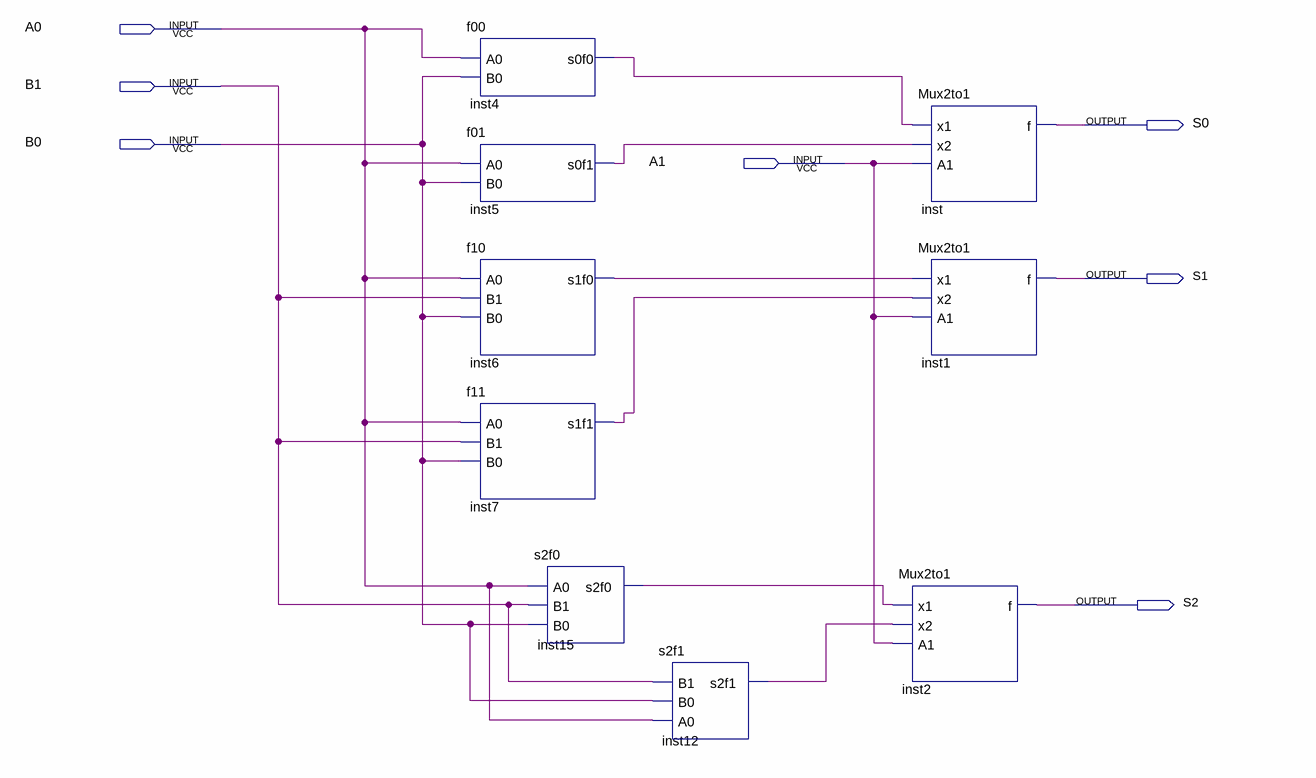
[diagram p0: schematic sheet]
// Quartus schematic Lab4.bdf as structural Verilog: 9 symbols, 7 pins
module Lab4 (
  input  A0,
  input  B1,
  input  B0,
  input  A1,
  output S0,
  output S1,
  output S2
);

  wire inst4_s0f0, inst5_s0f1, inst6_s1f0, inst7_s1f1, inst12_s2f1, inst15_s2f0;

  f00 inst4 (.A0(A0), .B0(B0), .s0f0(inst4_s0f0));
  f01 inst5 (.A0(A0), .B0(B0), .s0f1(inst5_s0f1));
  f10 inst6 (.A0(A0), .B1(B1), .B0(B0), .s1f0(inst6_s1f0));
  f11 inst7 (.A0(A0), .B1(B1), .B0(B0), .s1f1(inst7_s1f1));
  s2f0 inst15 (.A0(A0), .B1(B1), .B0(B0), .s2f0(inst15_s2f0));
  s2f1 inst12 (.B1(B1), .B0(B0), .A0(A0), .s2f1(inst12_s2f1));
  Mux2to1 inst2 (.x1(inst15_s2f0), .x2(inst12_s2f1), .A1(A1), .f(S2));
  Mux2to1 inst (.x1(inst4_s0f0), .x2(inst5_s0f1), .A1(A1), .f(S0));
  Mux2to1 inst1 (.x1(inst6_s1f0), .x2(inst7_s1f1), .A1(A1), .f(S1));
endmodule
